# Altium schematic sheet 02 Block Diagram.SchDoc
size 1188 x 840 mm
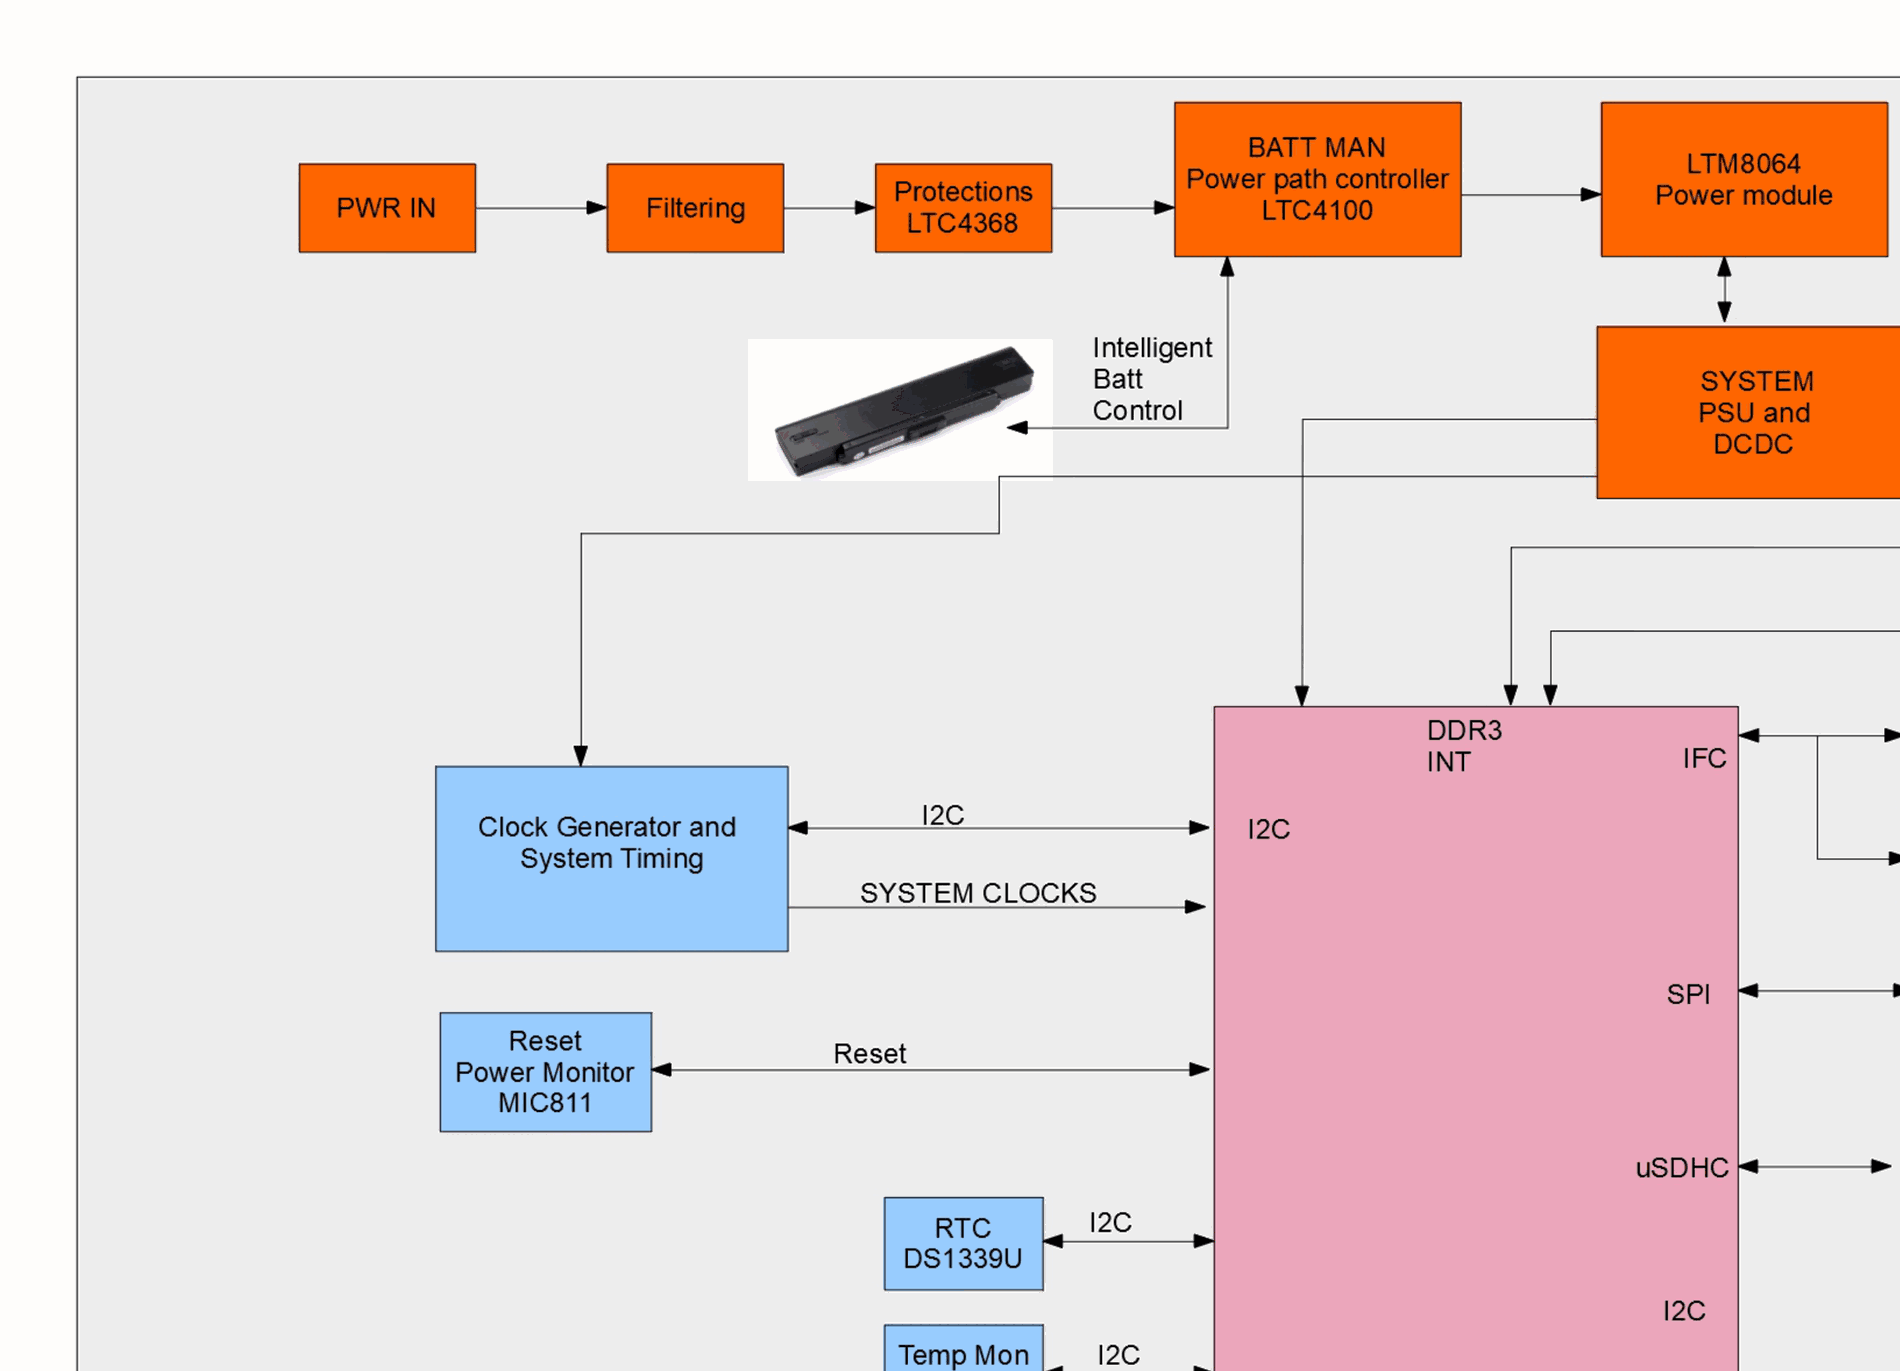
[diagram p0: 02 Block Diagram.SchDoc, top left]
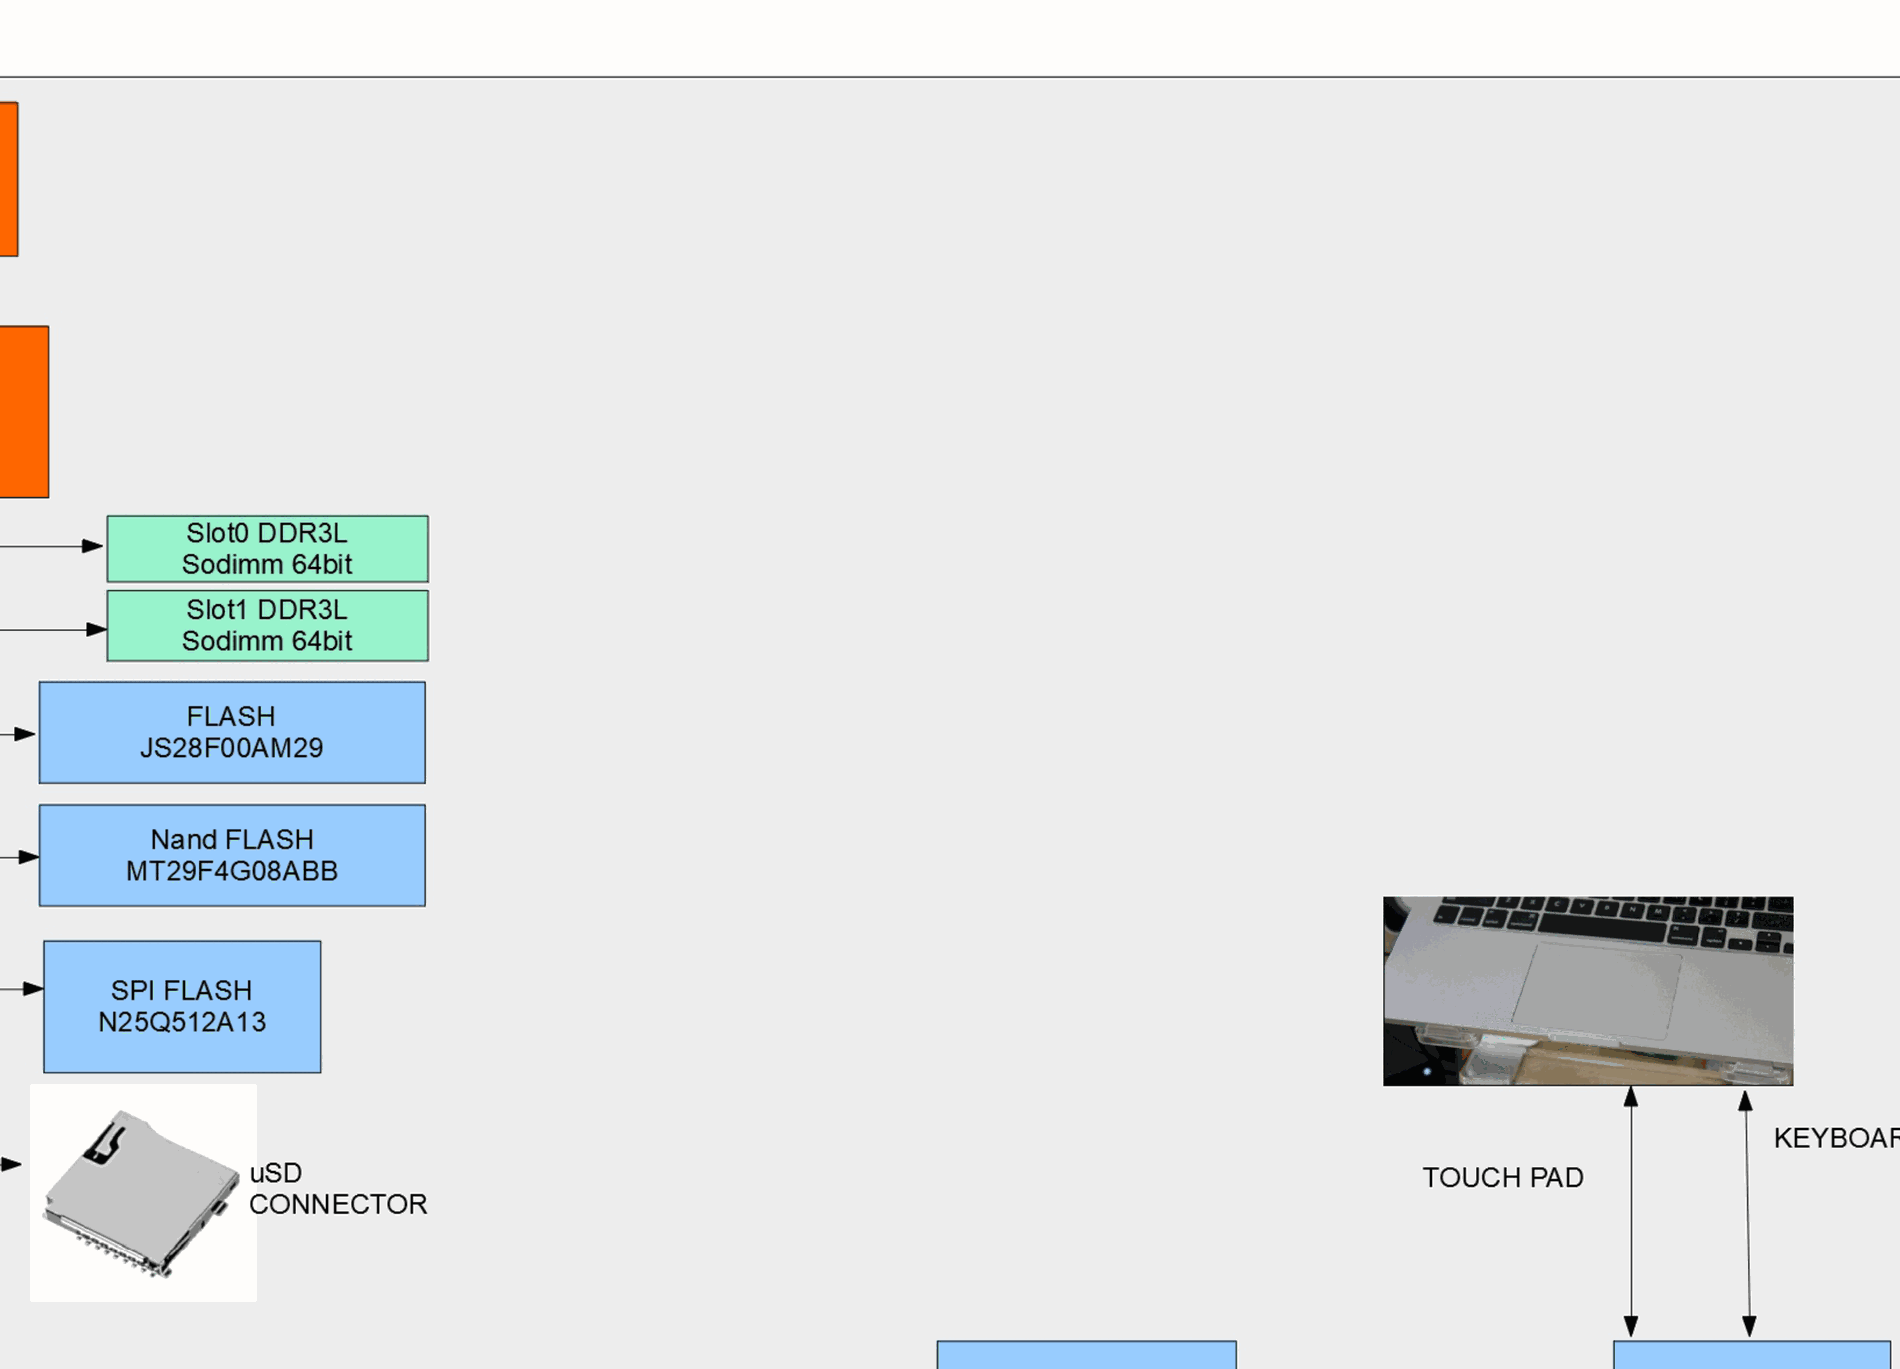
[diagram p1: 02 Block Diagram.SchDoc, top middle]
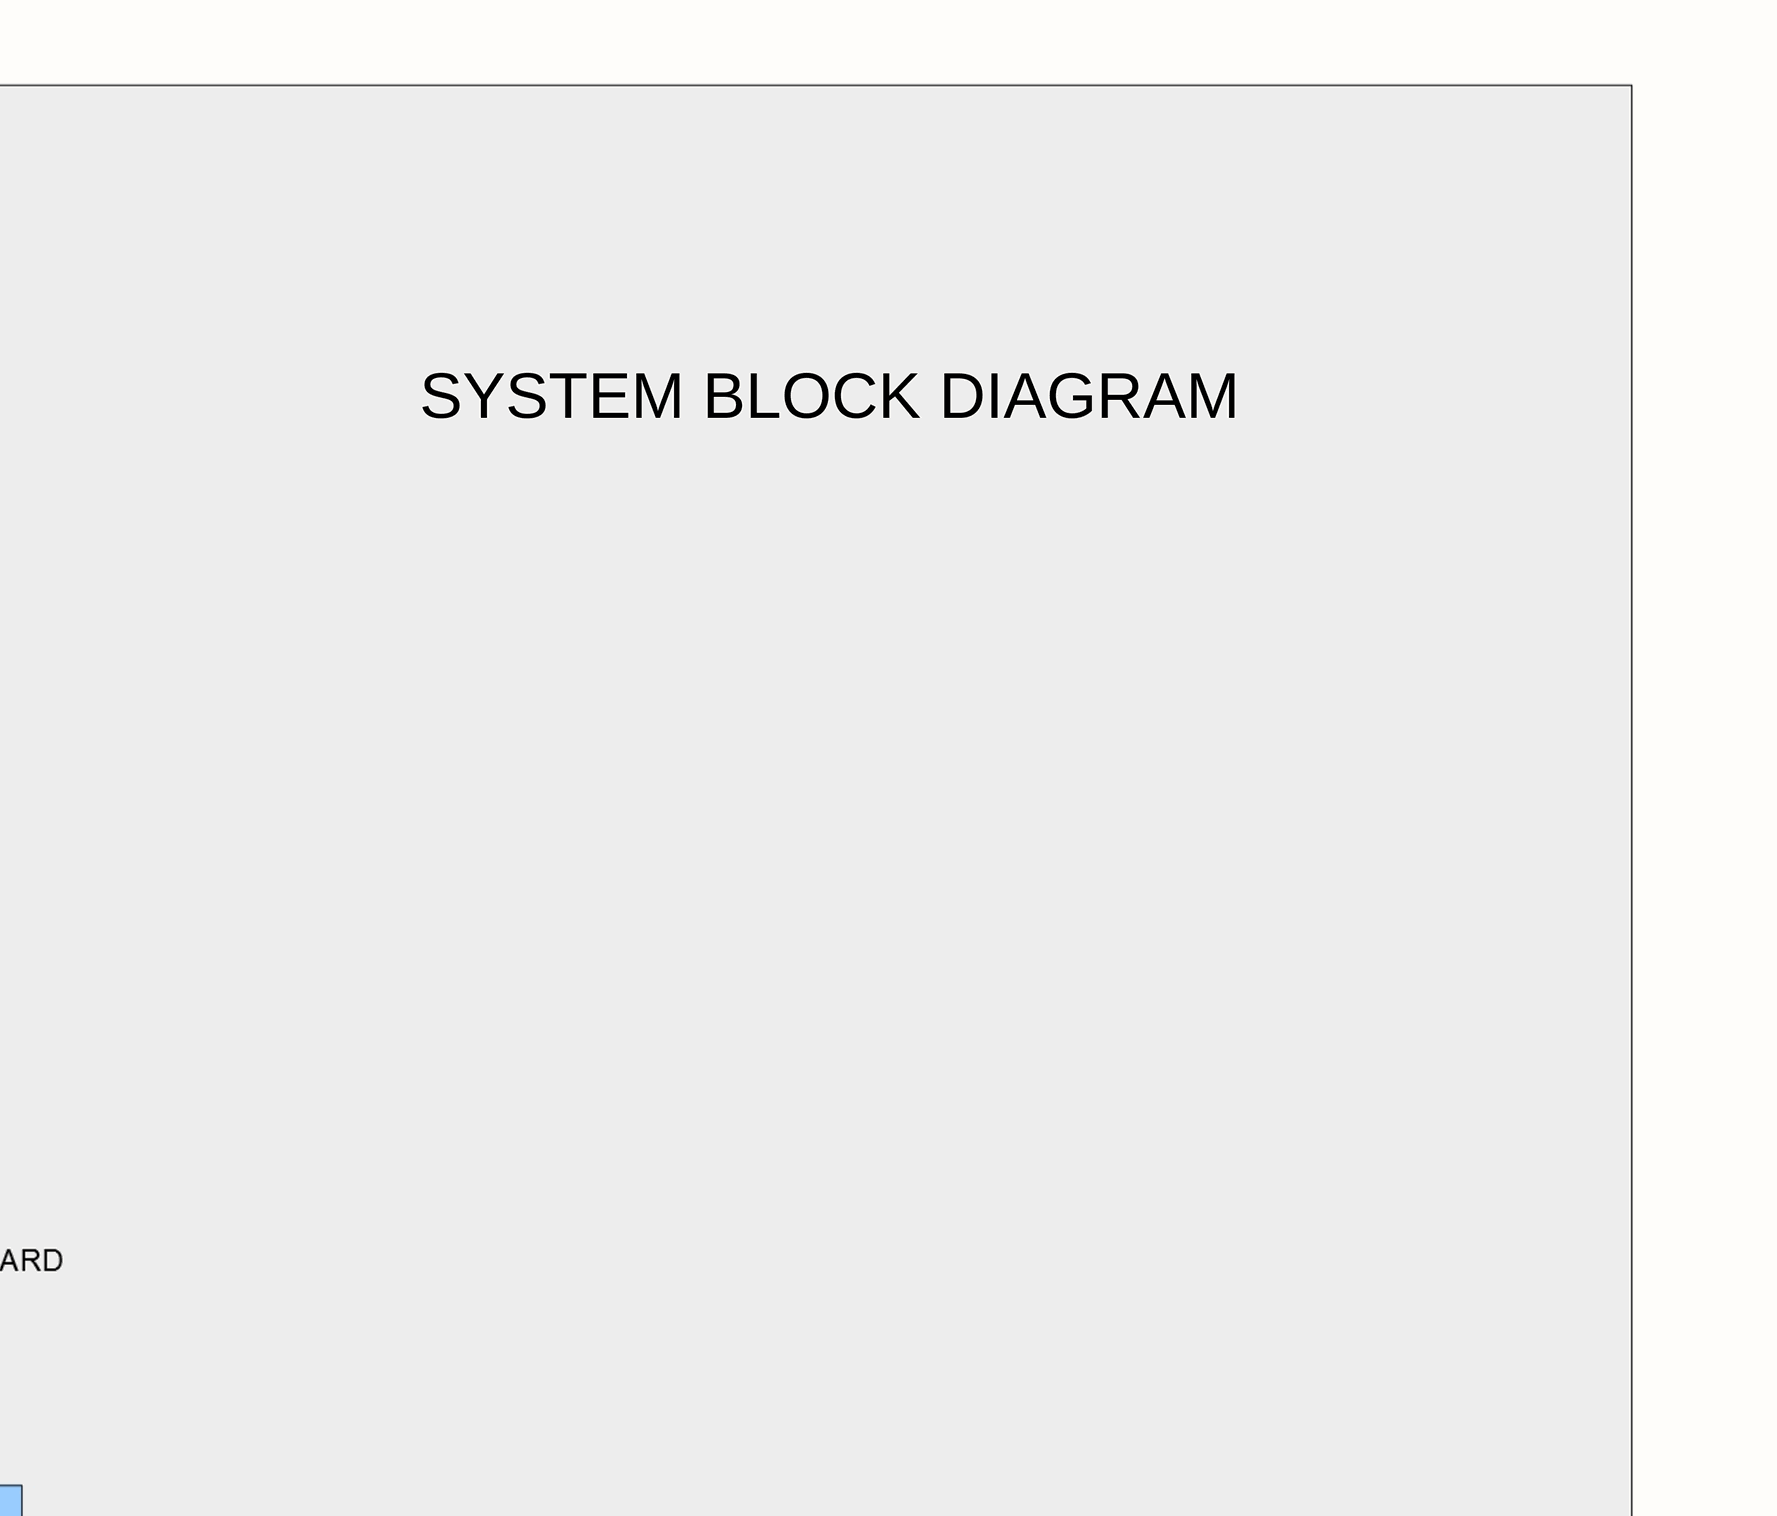
[diagram p2: 02 Block Diagram.SchDoc, top right]
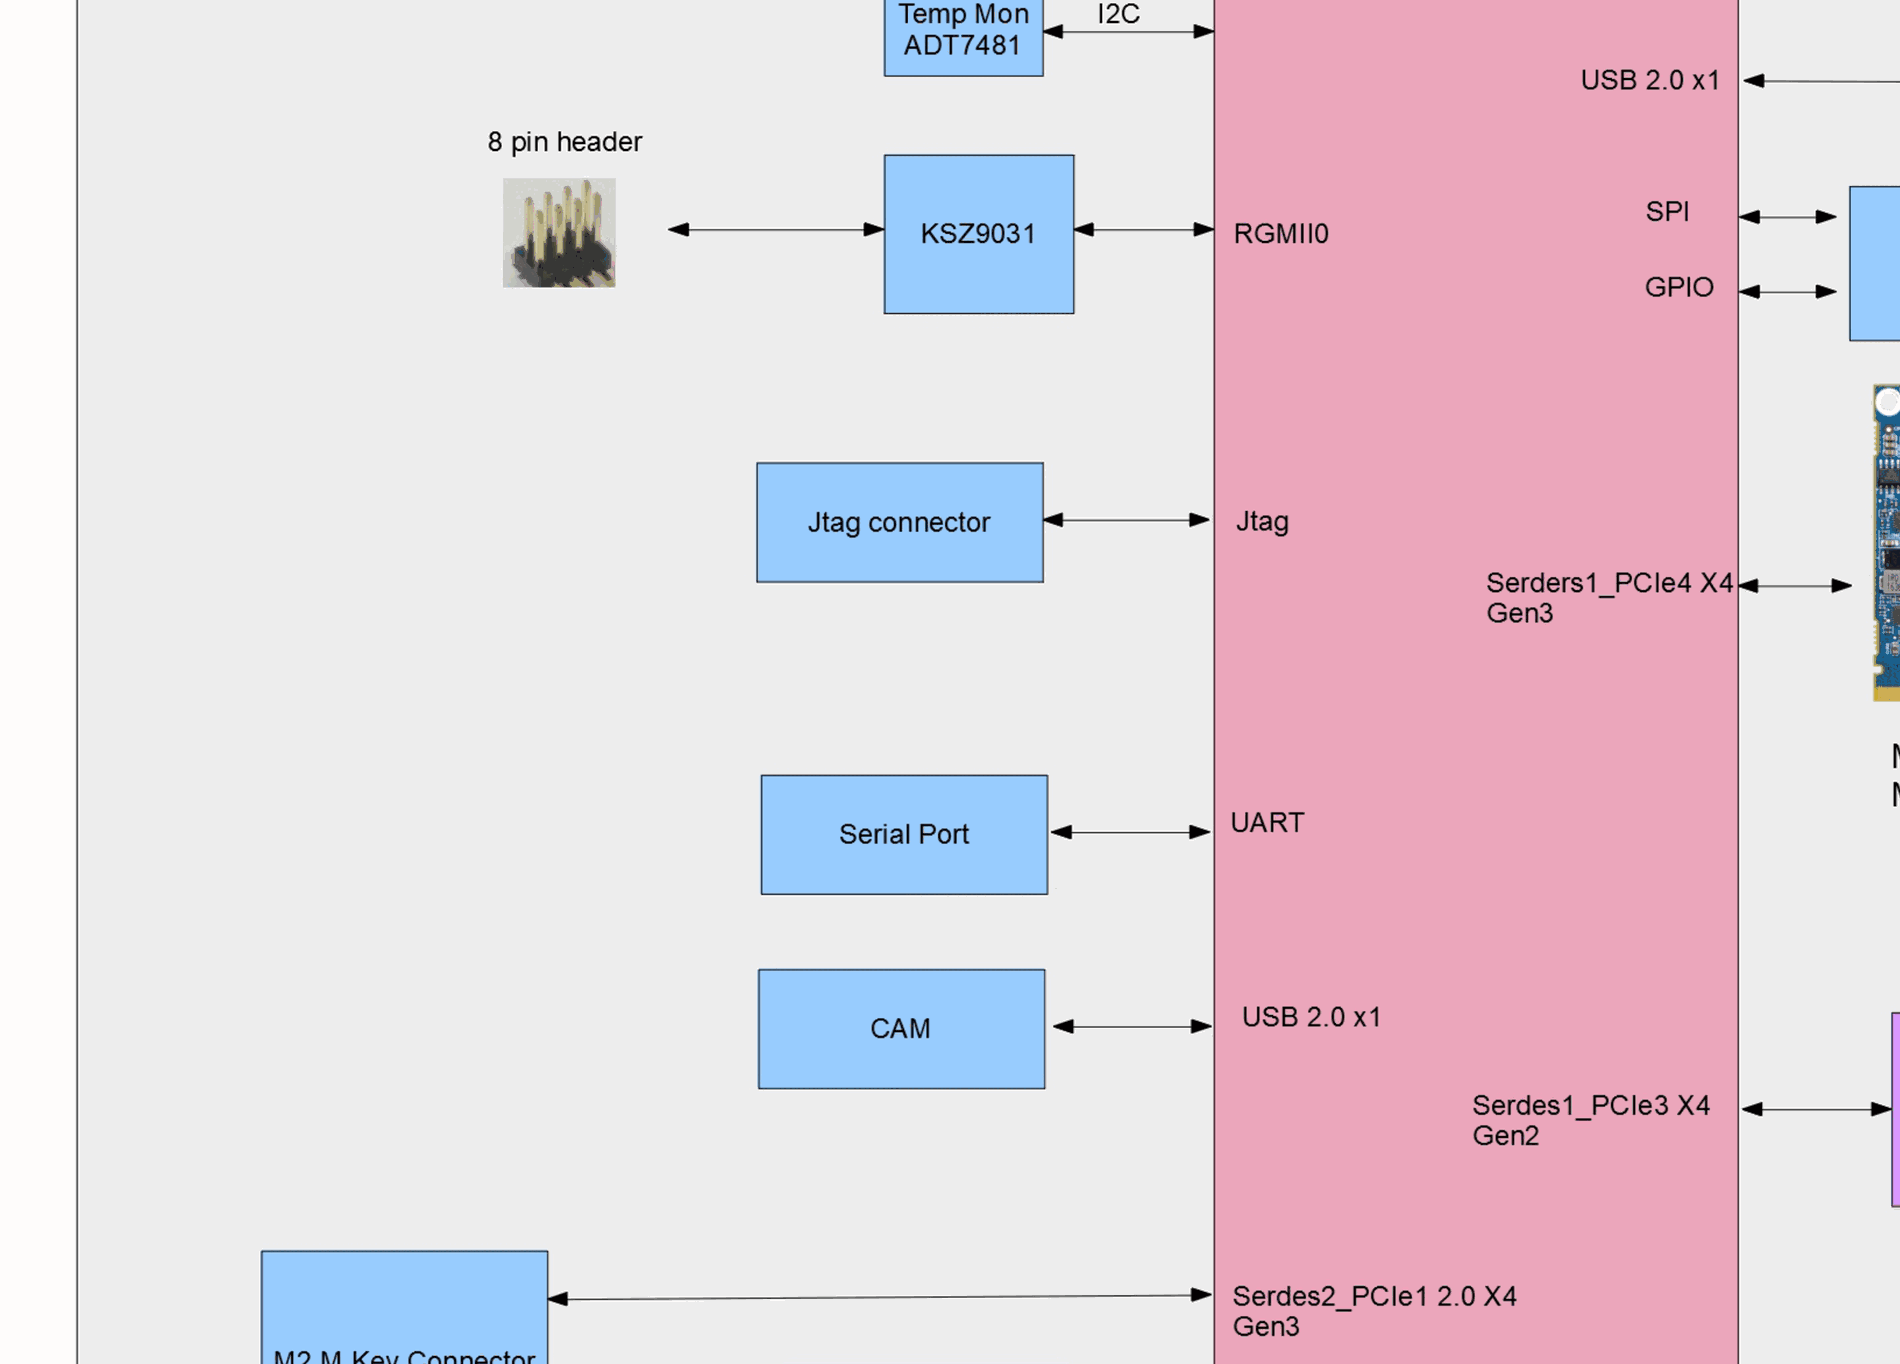
[diagram p3: 02 Block Diagram.SchDoc, centre left]
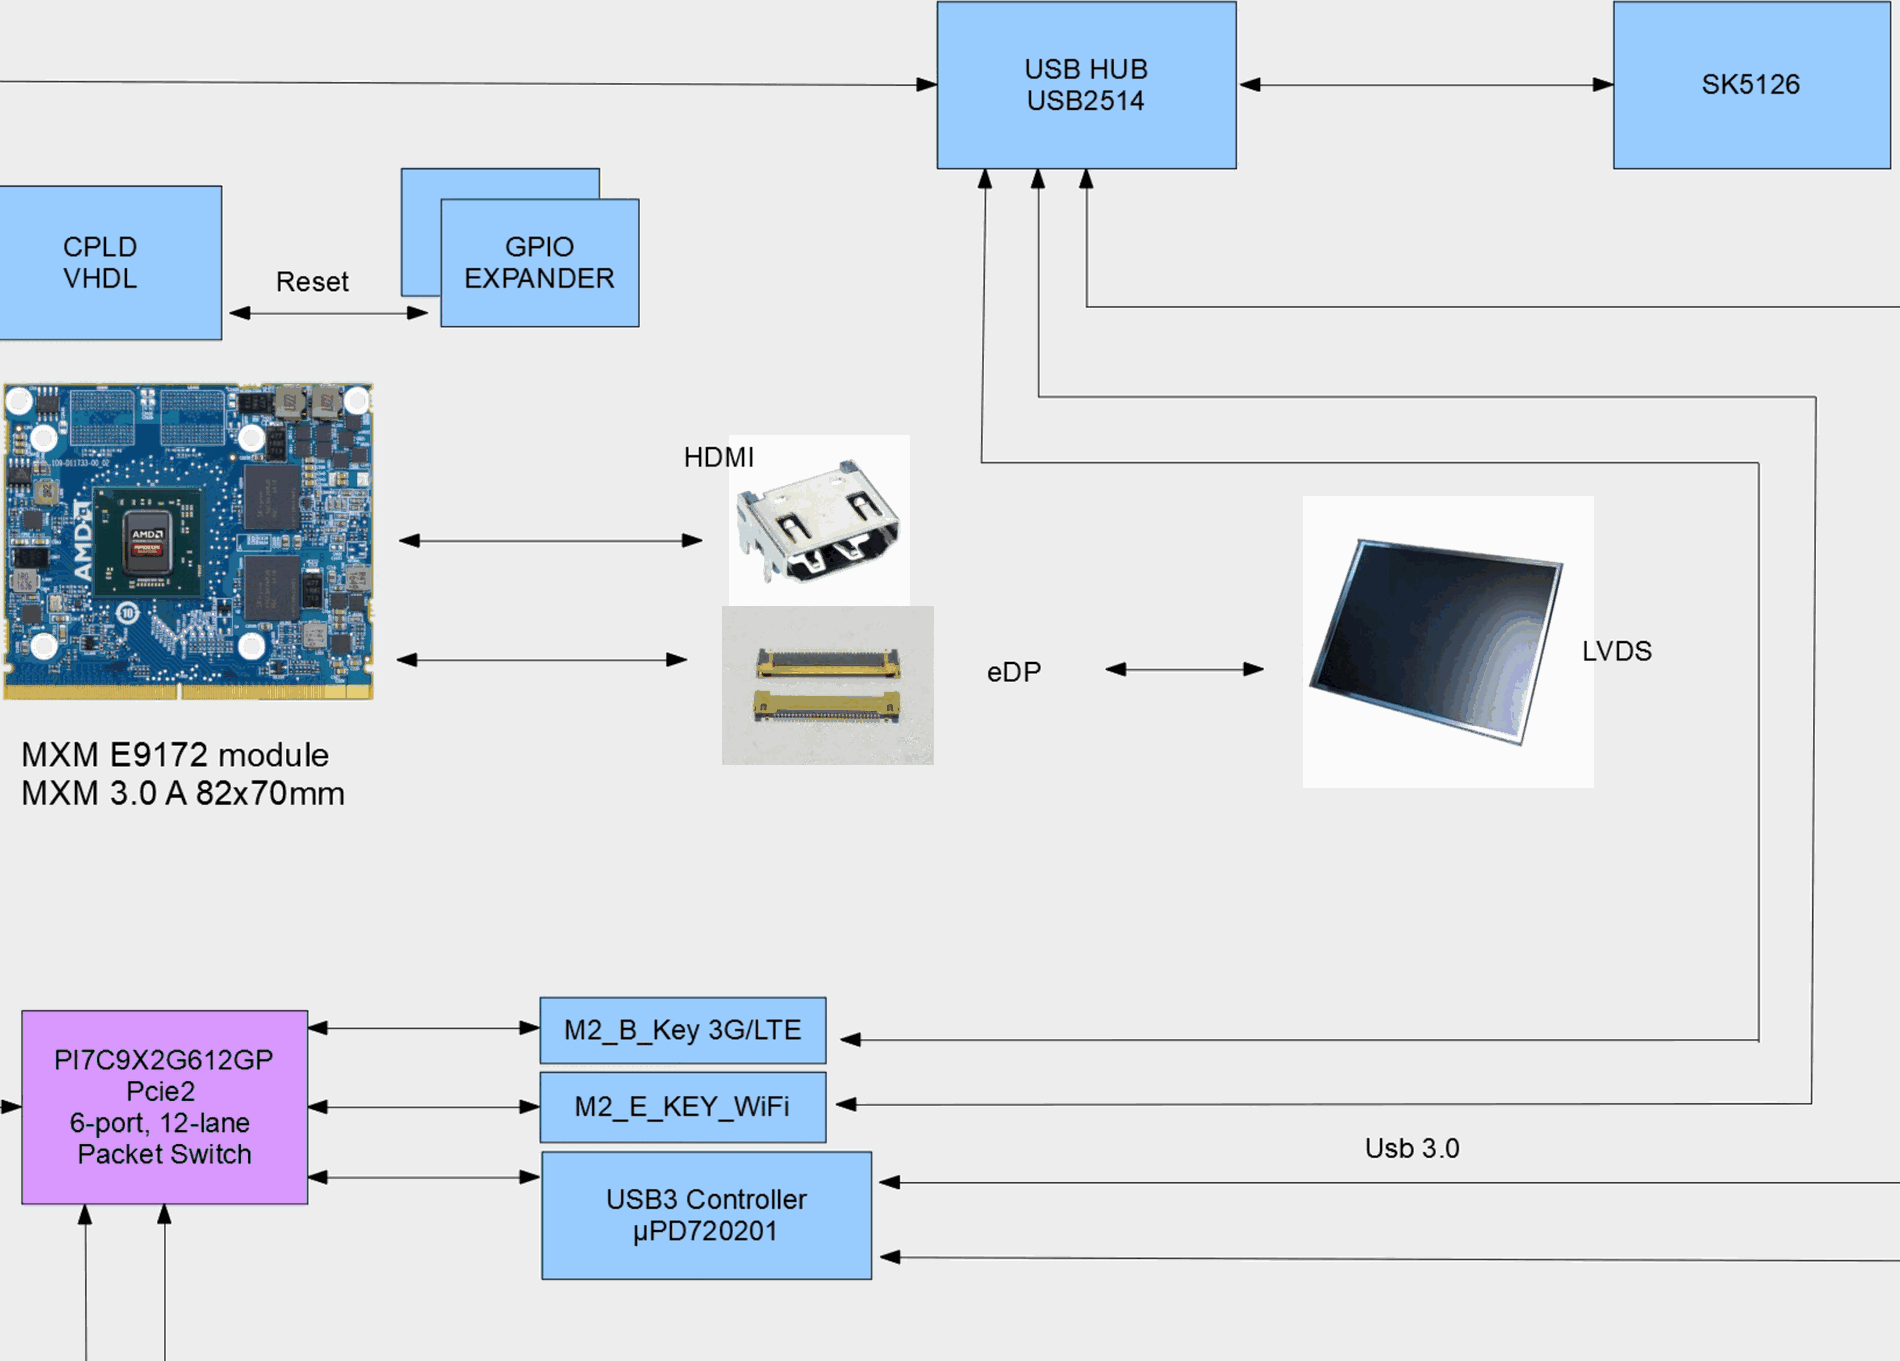
[diagram p4: 02 Block Diagram.SchDoc, centre middle]
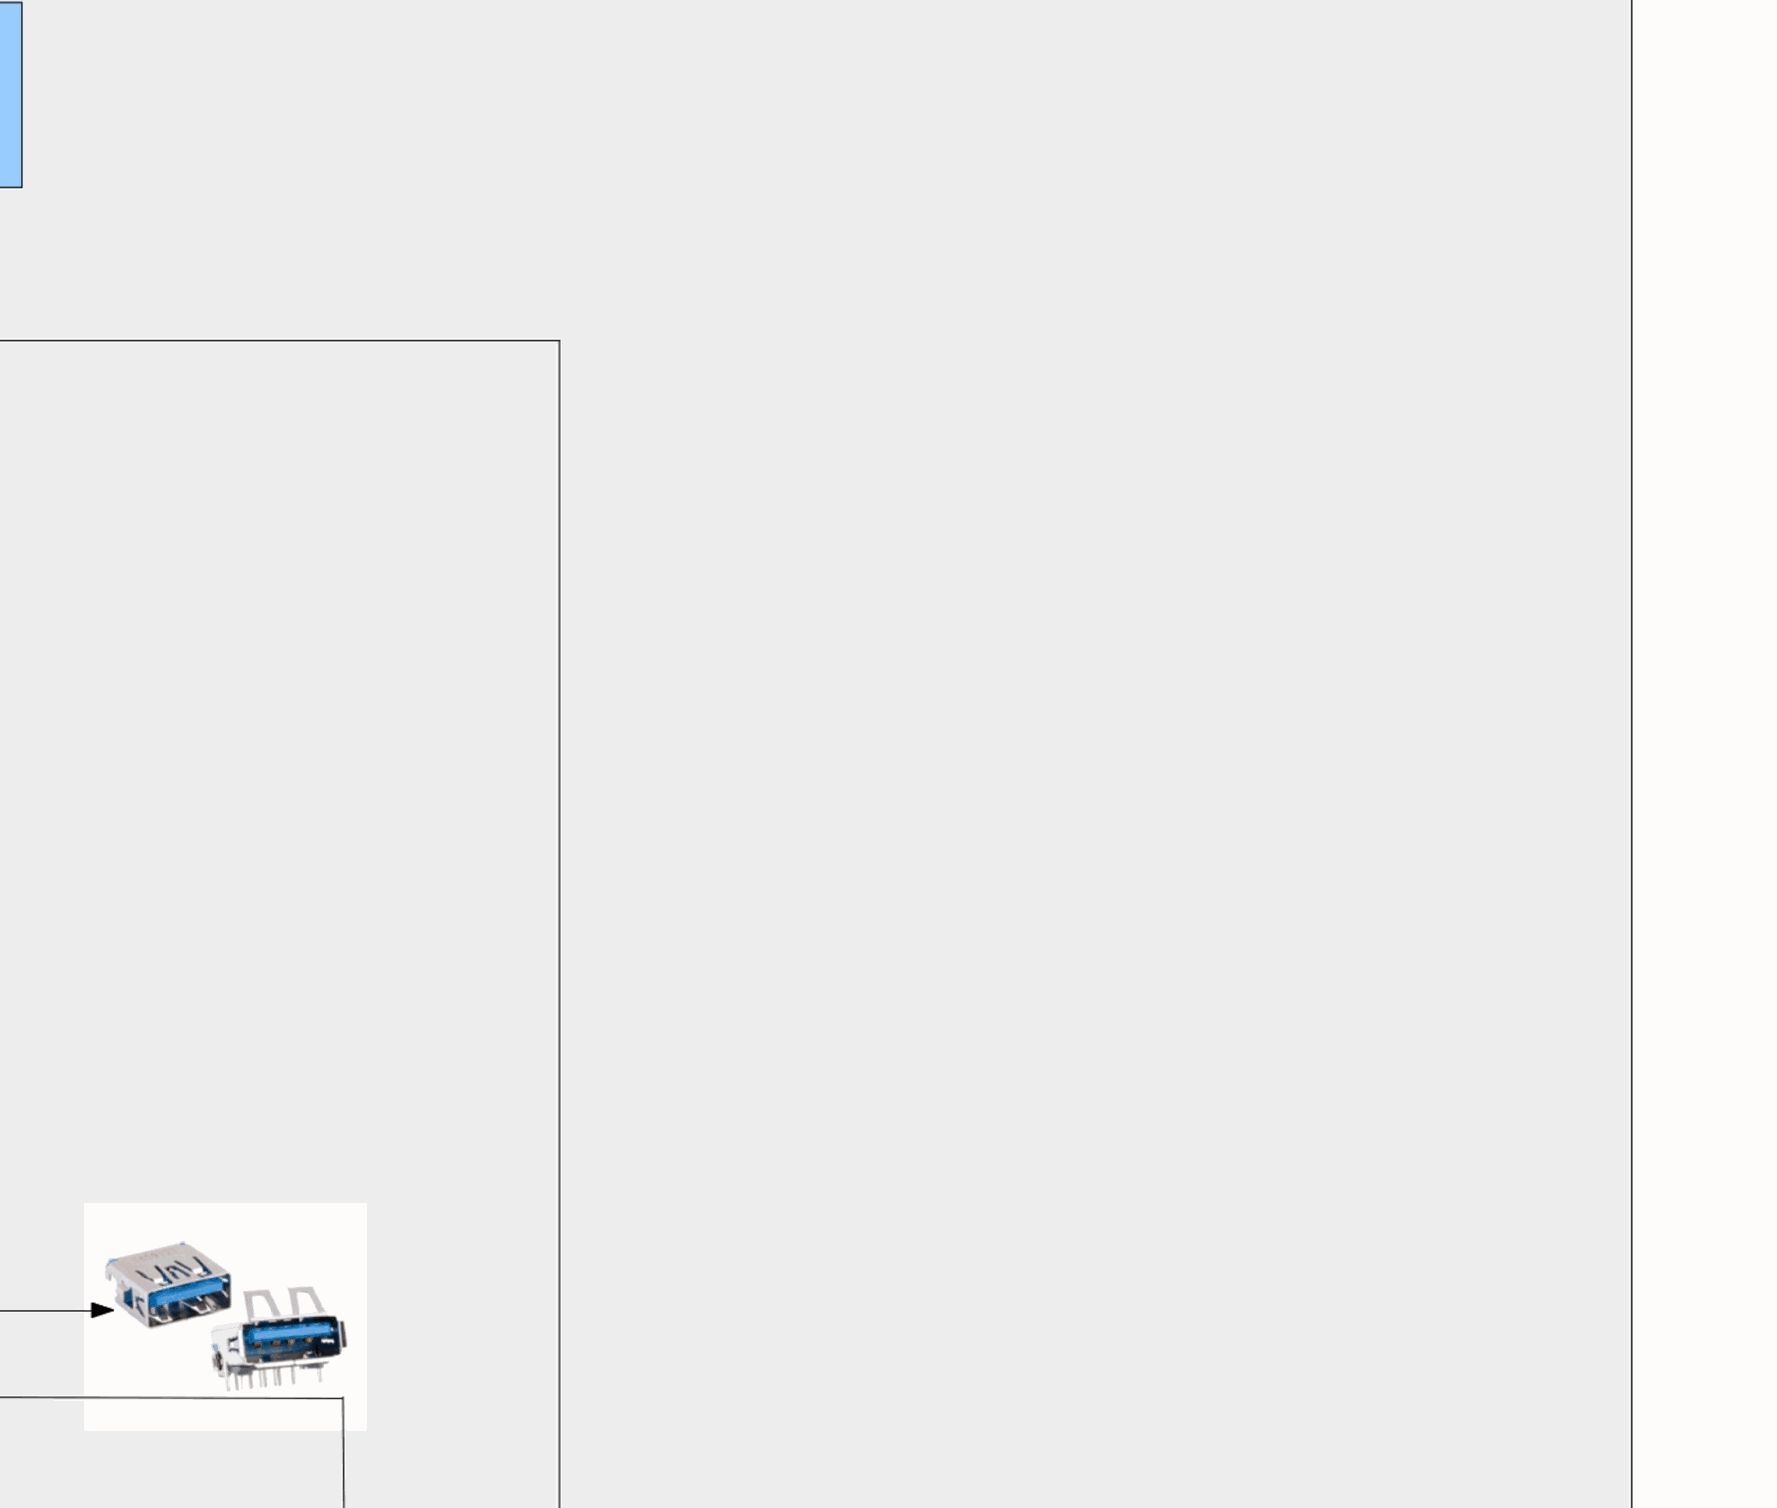
[diagram p5: 02 Block Diagram.SchDoc, centre right]
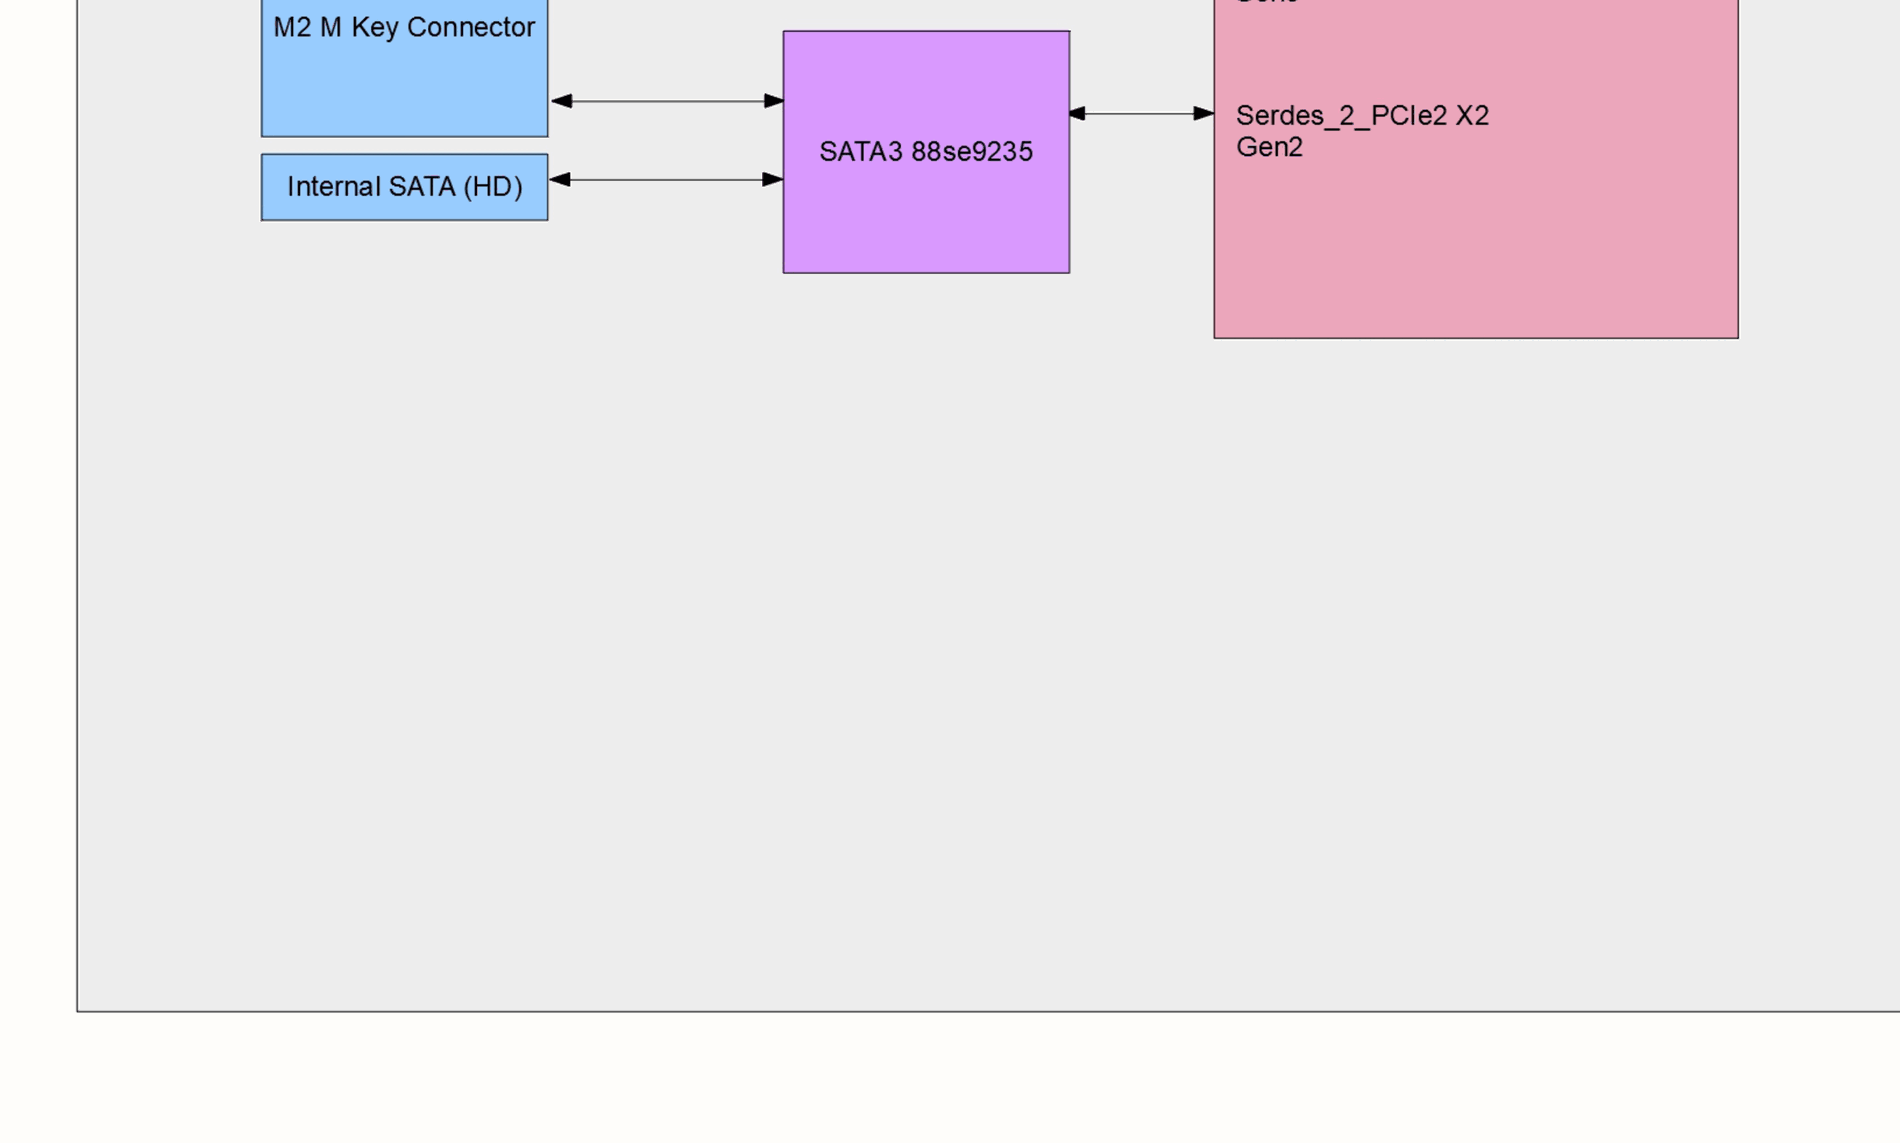
[diagram p6: 02 Block Diagram.SchDoc, bottom left]
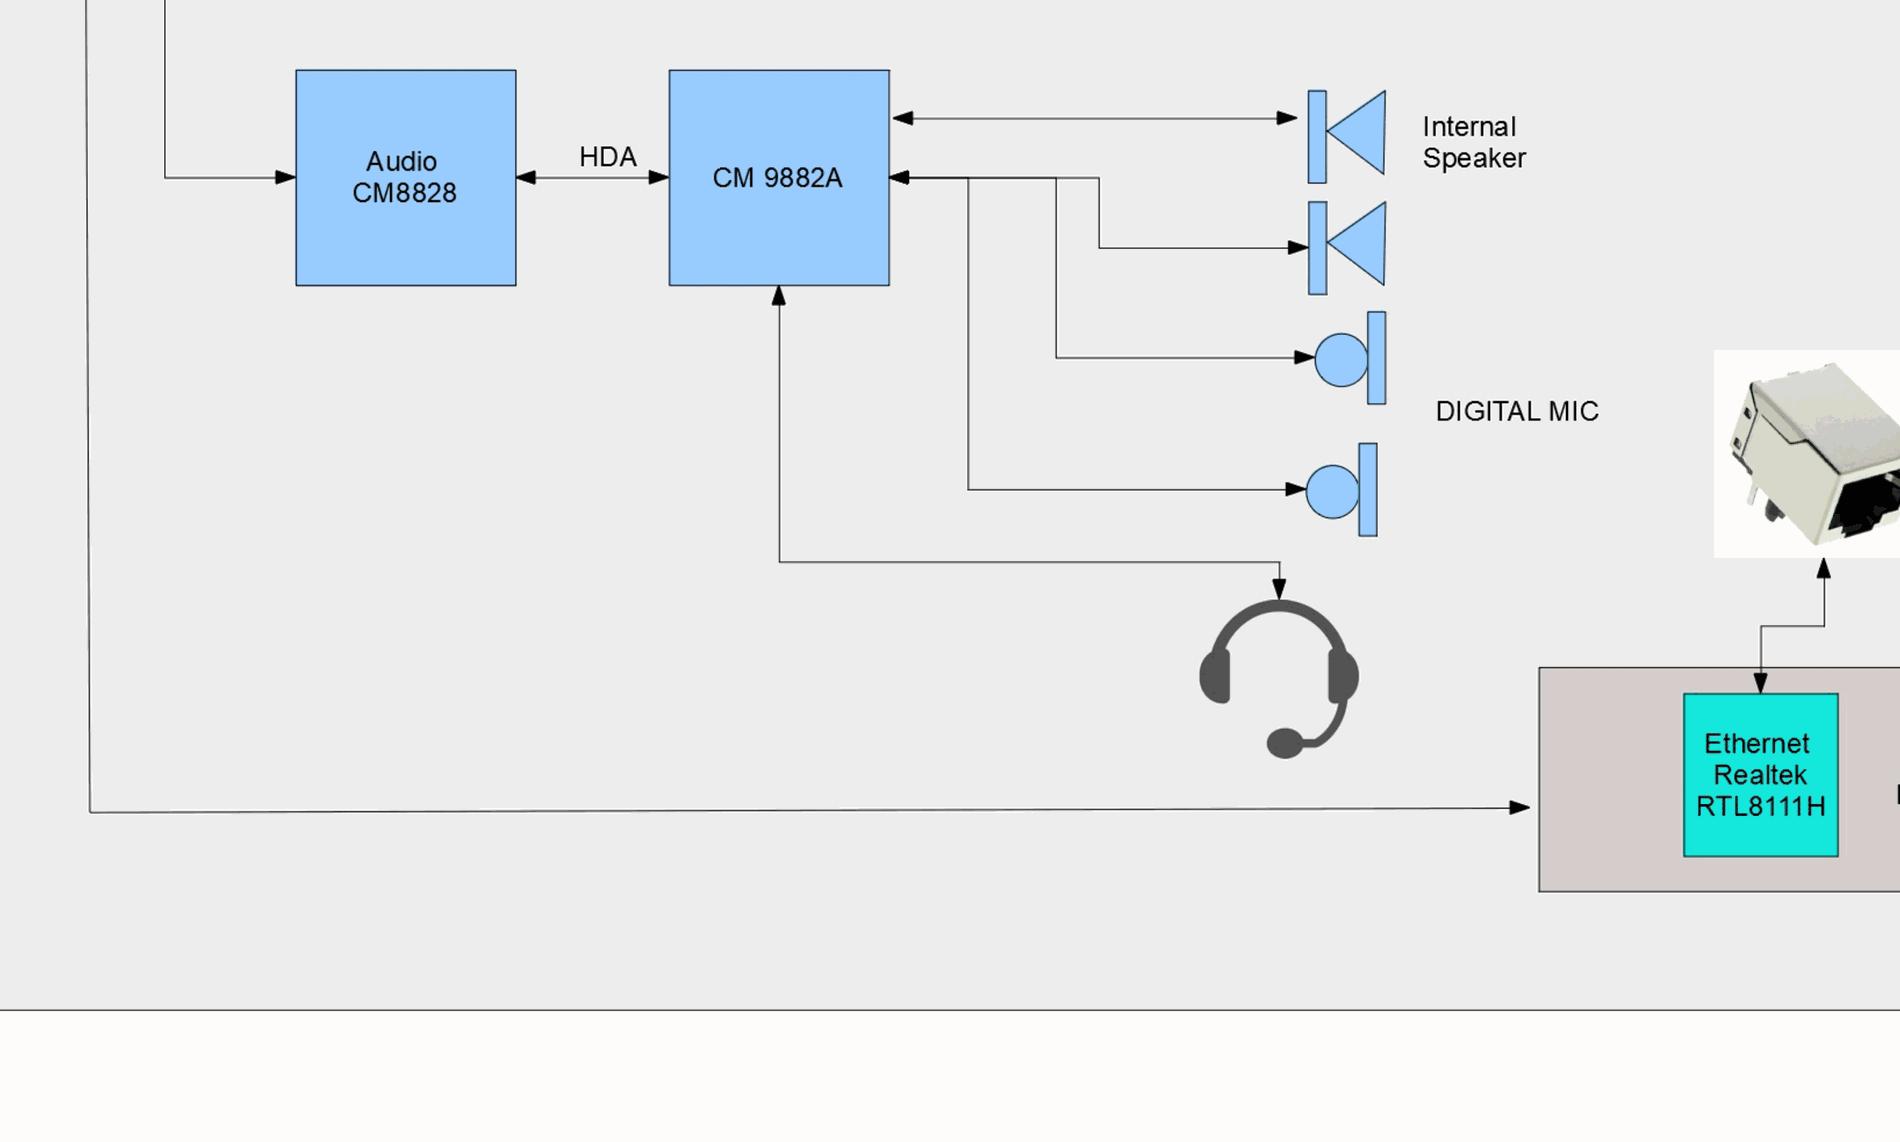
[diagram p7: 02 Block Diagram.SchDoc, bottom middle]
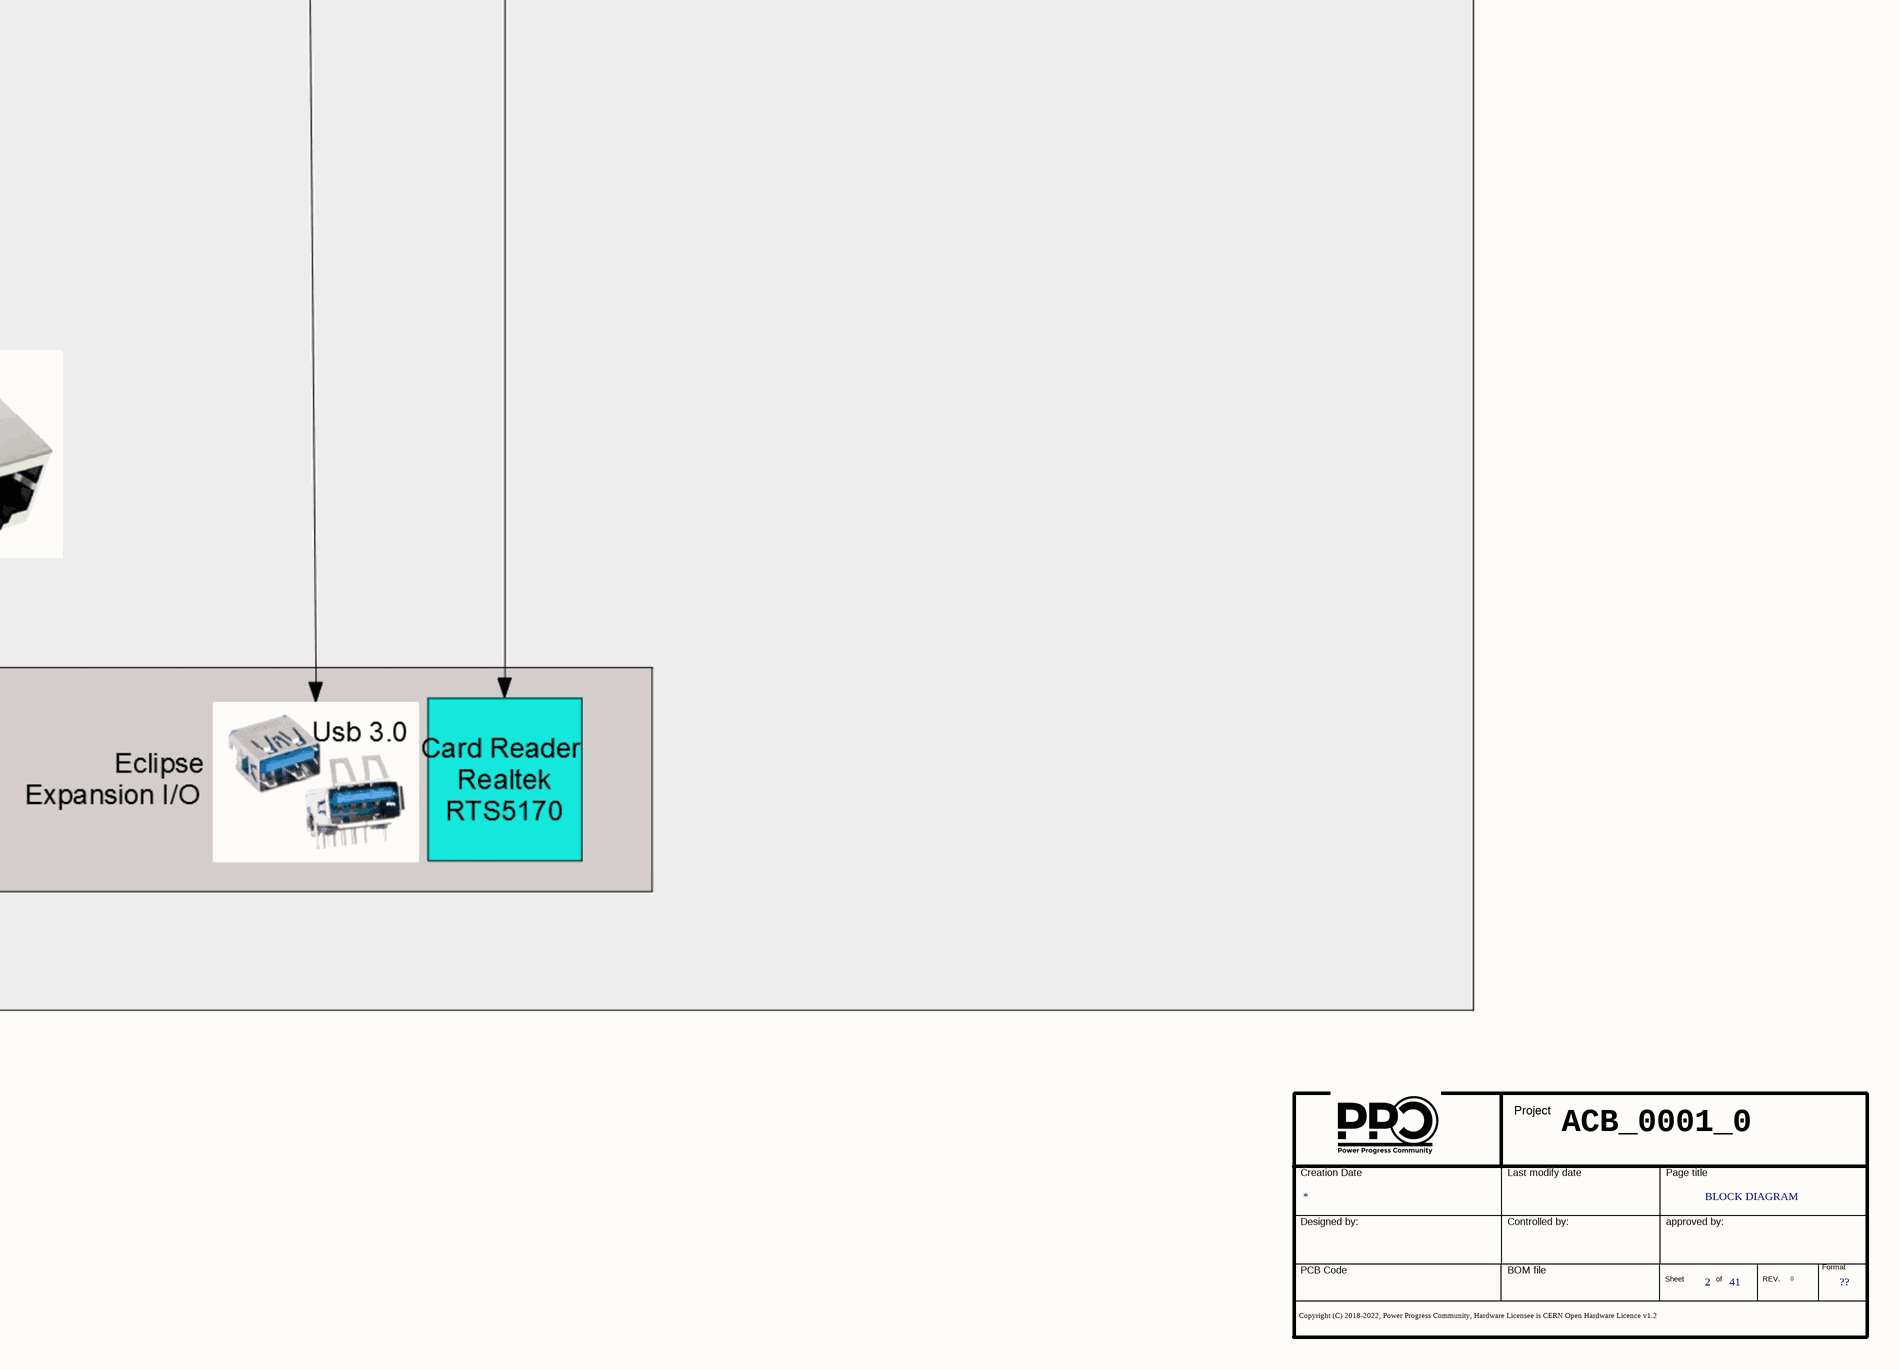
[diagram p8: 02 Block Diagram.SchDoc, bottom right]

## Parts
*  Doc: BLOCK DIAGRAM  Page Count: 41  Page Number: 2  Page Size: ??  RevCode: 0  (hidden comment: Title_block_PPC)  (graphical)

## Notes on the sheet
- SYSTEM BLOCK DIAGRAM
- ACB_0001_0
- (in symbol Title_block_PPC) Project; Creation Date; Last modify date; Page title; Designed by:; Controlled by:; approved by:; PCB Code; BOM file; Format; Sheet; of; REV.; Copyright (C) 2018-2022, Power Progress Community, Hardware Licensee is CERN Open Hardware Licence v1.2

## Library data of the parts
* = Title_block_PPC: Title: T2080PCIe; Author: MICETEK; Page Create Date: March  8, 1995; Page Title: ?; Page Modify Date: *